# Altium schematic sheet Main.SchDoc
size A4
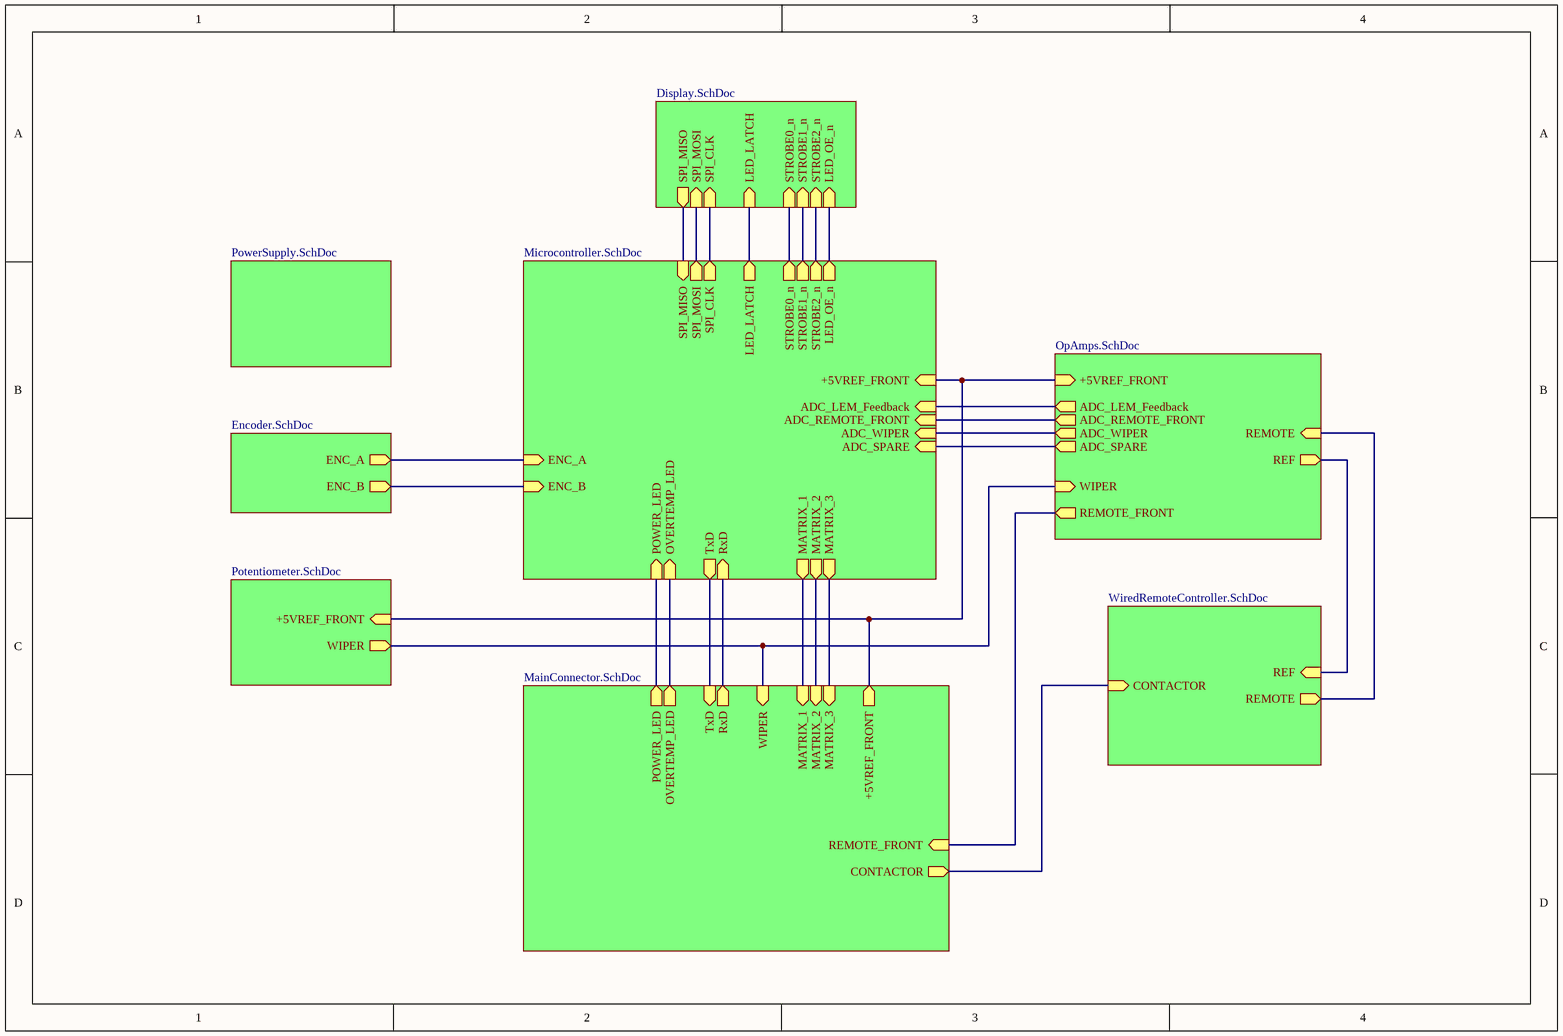
[diagram p0: Main.SchDoc]

## Sub-sheets
C = MainConnector.SchDoc: CONTACTOR (out), POWER_LED (out), RxD (out), +5VREF_FRONT (out), OVERTEMP_LED (out), REMOTE_FRONT (in), WIPER (in), MATRIX_3 (in), MATRIX_2 (in), MATRIX_1 (in), TxD (in)
D = Display.SchDoc: SPI_MOSI (in), LED_LATCH (in), STROBE0_n (in), SPI_MISO (out), SPI_CLK (in), STROBE1_n (in), LED_OE_n (in), STROBE2_n (in)
E = Encoder.SchDoc: ENC_B (out), ENC_A (out)
MC = Microcontroller.SchDoc: ADC_REMOTE_FRONT (in), MATRIX_1 (out), MATRIX_3 (out), ADC_LEM_Feedback (in), MATRIX_2 (out), ADC_SPARE (in), ADC_WIPER (in), +5VREF_FRONT (in), ENC_B (in), LED_OE_n (out), LED_LATCH (out), ENC_A (in), STROBE0_n (out), SPI_CLK (out), SPI_MOSI (out), STROBE2_n (out), STROBE1_n (out), SPI_MISO (in), POWER_LED (in), OVERTEMP_LED (in), RxD (in), TxD (out)
OA = OpAmps.SchDoc: REMOTE (in), ADC_WIPER (out), REMOTE_FRONT (out), ADC_REMOTE_FRONT (out), WIPER (in), ADC_SPARE (out), ADC_LEM_Feedback (out), +5VREF_FRONT (in), REF (out)
P = Potentiometer.SchDoc: WIPER (out), +5VREF_FRONT (in)
PS = PowerSupply.SchDoc: no entries
RC = WiredRemoteController.SchDoc: REF (in), REMOTE (out), CONTACTOR (in)

## Nets
(unnamed): sheet MC/ADC_REMOTE_FRONT, sheet OA/ADC_REMOTE_FRONT
(unnamed): sheet MC/MATRIX_1, sheet C/MATRIX_1
(unnamed): sheet MC/MATRIX_3, sheet C/MATRIX_3
(unnamed): sheet MC/ADC_LEM_Feedback, sheet OA/ADC_LEM_Feedback
(unnamed): sheet MC/MATRIX_2, sheet C/MATRIX_2
(unnamed): sheet MC/ADC_SPARE, sheet OA/ADC_SPARE
(unnamed): sheet MC/ADC_WIPER, sheet OA/ADC_WIPER
(unnamed): sheet MC/+5VREF_FRONT, sheet OA/+5VREF_FRONT, sheet P/+5VREF_FRONT, sheet C/+5VREF_FRONT
(unnamed): sheet MC/ENC_B, sheet E/ENC_B
(unnamed): sheet MC/LED_OE_n, sheet D/LED_OE_n
(unnamed): sheet MC/LED_LATCH, sheet D/LED_LATCH
(unnamed): sheet MC/ENC_A, sheet E/ENC_A
(unnamed): sheet MC/STROBE0_n, sheet D/STROBE0_n
(unnamed): sheet MC/SPI_CLK, sheet D/SPI_CLK
(unnamed): sheet MC/SPI_MOSI, sheet D/SPI_MOSI
(unnamed): sheet MC/STROBE2_n, sheet D/STROBE2_n
(unnamed): sheet MC/STROBE1_n, sheet D/STROBE1_n
(unnamed): sheet MC/SPI_MISO, sheet D/SPI_MISO
(unnamed): sheet MC/POWER_LED, sheet C/POWER_LED
(unnamed): sheet MC/OVERTEMP_LED, sheet C/OVERTEMP_LED
(unnamed): sheet MC/RxD, sheet C/RxD
(unnamed): sheet MC/TxD, sheet C/TxD
(unnamed): sheet OA/REMOTE, sheet RC/REMOTE
(unnamed): sheet OA/REMOTE_FRONT, sheet C/REMOTE_FRONT
(unnamed): sheet OA/WIPER, sheet P/WIPER, sheet C/WIPER
(unnamed): sheet OA/REF, sheet RC/REF
(unnamed): sheet RC/CONTACTOR, sheet C/CONTACTOR